# EAGLE design AV_Board (EAGLE 9.6.2)
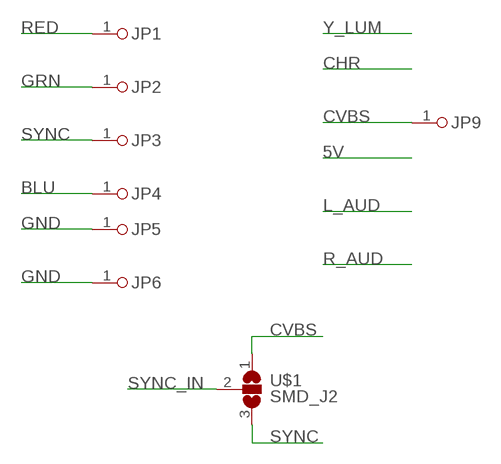
[diagram p0: schematic, sheet 1]

## Parts
JP1  PINHD-1X1  [1X01]
JP2  PINHD-1X1  [1X01]
JP3  PINHD-1X1  [1X01]
JP4  PINHD-1X1  [1X01]
JP5  PINHD-1X1  [1X01]
JP6  PINHD-1X1  [1X01]
JP9  PINHD-1X1  [1X01]
U$1  SMD_J2  [SJ_2]

## Nets
BLU: JP4.1
CVBS: JP9.1 U$1.1
GND: JP5.1 JP6.1
GRN: JP2.1
RED: JP1.1
SYNC: JP3.1 U$1.3
SYNC_IN: U$1.2

## Library data of the parts
JP1-JP6 JP9 = My_Devices:PINHD-1X1: PIN HEADER
U$1 = My_Devices:SMD_J2

## Board
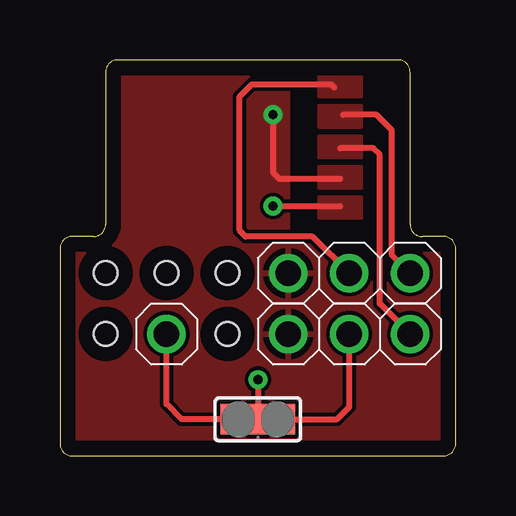
[diagram p1: board, top side]
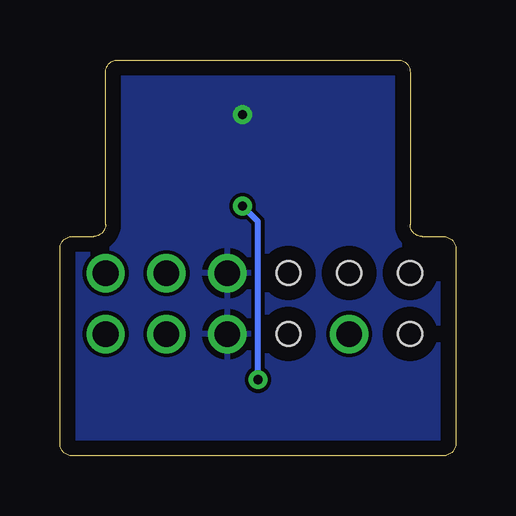
[diagram p2: board, bottom side, seen from below]

Size 16.51 x 16.51 mm. Coordinates in mm from the lower left corner, seen from the top.
Outline: 0.51,0 16,0 arc90 16.51,0.51 16.51,8.64 arc90 16,9.14 15.11,9.14 arc-90 14.61,9.65 14.61,16 arc90 14.1,16.51 2.41,16.51 arc90 1.91,16 1.91,9.65 arc-90 1.4,9.14 0.51,9.14 arc90 0,8.64 0,0.51 arc90 0.51,0
Copper layers (1*16): Top 0.035mm / dielectric 1.5mm / Bottom 0.035mm
Design rules "default *": minimum track width 6mil, minimum drill 0.35mm, track to track 6mil, track to pad 6mil, pad to pad 6mil, via to via 6mil, smd to smd 6mil, copper to edge 25mil, drill to drill 6mil, minimum pad ring 10mil, minimum via ring 8mil, stop-mask expansion 4mil, vias tented up to drill 0mil, thermal gap 10mil
Holes 0.99 mm at 1.91,7.62 1.91,5.08 6.99,5.08 6.99,7.62 4.45,7.62

### Footprints (pad centres in the part's own frame; a part is rotated, then mirrored left to right if it is on the bottom)
1X01 = drill 1.067 pad 1.575: 1 0,0
SJ_2 = smd 0.813 x 1.27: 1 -1.143,0; 2 0,0; 3 1.143,0

### Placement (x,y rotation side)
JP1  14.61,5.08 0 top
JP2  14.61,7.62 0 top
JP3  12.06,5.08 0 top
JP4  12.06,7.62 0 top
JP5  9.53,5.08 0 top
JP6  9.53,7.62 0 top
JP9  4.45,5.08 0 top
U$1  8.26,1.52 0 top

### Tracks (layer width: path | path; a pad name or v marks a point on that pad's centre or on a via)
BLU
  Top 0.254: JP4.1 10.54,9.14 7.75,9.14 7.49,9.4 7.49,14.99 8,15.49 11.3,15.49 11.43,15.37
  pour Top: 10.79,15.88 10.79,14.99 12.57,14.99 12.57,15.88
CVBS
  Top 0.254: U$1.1 5.08,1.52 4.45,2.16 JP9.1
GND  (via drill 0.38)
  Top 0.254: v8.89,14.22 8.89,11.81 9.14,11.56 11.68,11.56
  pour Top (rank 2): -1.91,17.78 -1.91,-1.27 19.68,-1.27 19.68,8.89 9.53,8.89 9.53,17.78
  pour Top: 10.79,12.06 10.79,11.18 12.57,11.18 12.57,12.06
  pour Bottom: -5.71,20.32 -5.71,-1.27 19.68,-1.27 19.68,20.32
GRN
  Top 0.254: JP2.1 13.84,8.38 13.84,13.59 13.21,14.22 11.81,14.22
  pour Top: 10.79,14.61 10.79,13.72 12.57,13.72 12.57,14.61
RED
  Top 0.254: JP1.1 13.34,6.35 13.34,12.57 13.08,12.83 11.68,12.83
  pour Top: 10.79,13.34 10.79,12.45 12.57,12.45 12.57,13.34
SYNC
  Top 0.254: U$1.3 11.56,1.52 12.06,2.03 JP3.1
SYNC_IN  (via drill 0.38)
  Top 0.254: v8.26,3.17 U$1.2 | v8.89,10.41 11.68,10.41
  Bottom 0.254: v8.26,3.17 8.26,9.78 v8.89,10.41
  pour Top: 10.79,10.79 10.79,9.91 12.57,9.91 12.57,10.79

### Text on the board
tDocu: B | G | R | GND | S | CVBS | Sync
bDocu: N64 TWRGB "Buddy" Board / @zaxour